# Altium schematic sheet ESP_SoC.SchDoc
size A3
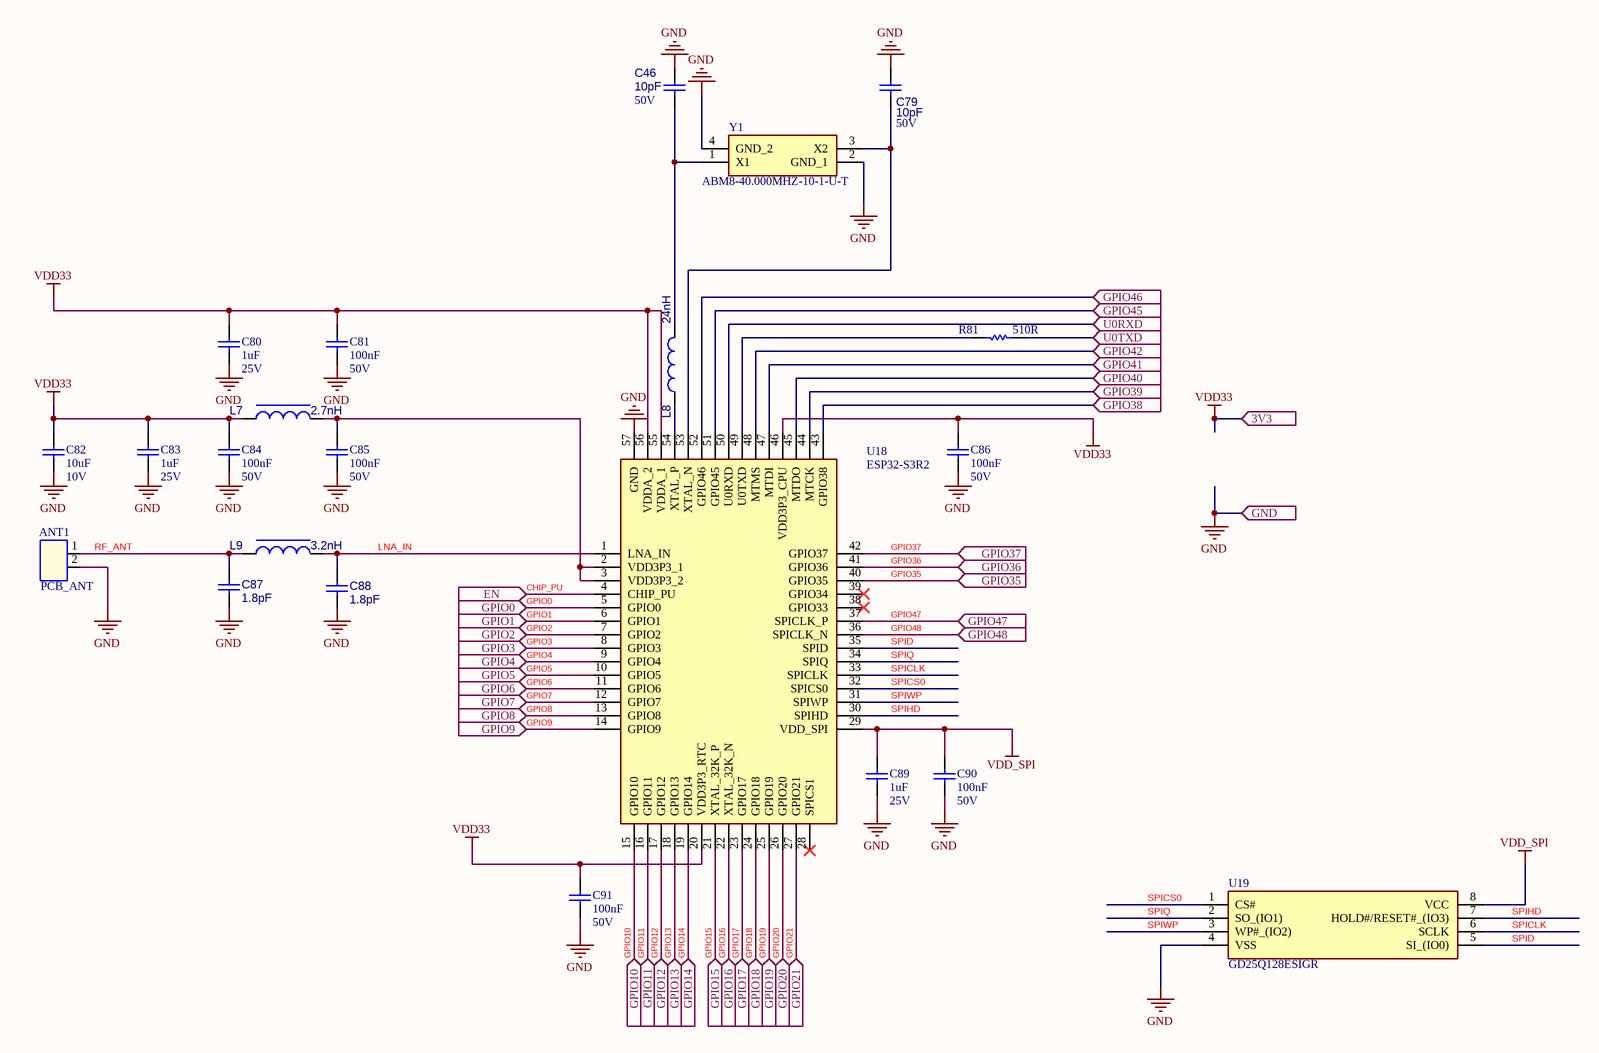
[diagram p0: ESP_SoC.SchDoc]

## Parts
ANT1  PCB_ANT  [MINI-ANT-TYPEB]  (no BOM)
C46  value 10pF  Voltage: 50V  [CAP_0603]  (hidden comment: CL10C100JB8NNNC)
C79  value 10pF  Voltage: 50V  [CAP_0603]  (hidden comment: CL10C100JB8NNNC)
C80  value 1uF  Voltage: 25V  [CAP_0603]  (hidden comment: CL10A105KA8NNNC)
C81  value 100nF  Voltage: 50V  [CAP_0603]  (hidden comment: CAP)
C82  value 10uF  Voltage: 10V  [CAP_0603]  (hidden comment: CL10A106MP8NNNC)
C83  value 1uF  Voltage: 25V  [CAP_0603]  (hidden comment: CL10A105KA8NNNC)
C84  value 100nF  Voltage: 50V  [CAP_0603]  (hidden comment: CL10B104KB8NNNL)
C85  value 100nF  Voltage: 50V  [CAP_0603]  (hidden comment: CL10B104KB8NNNL)
C86  value 100nF  Voltage: 50V  [CAP_0603]  (hidden comment: CL10B104KB8NNNL)
C87  value 1.8pF  [CAP_0402]  (hidden comment: GJM1555C1H1R8CB01J)
C88  value 1.8pF  [CAP_0402]  (hidden comment: GJM1555C1H1R8CB01J)
C89  value 1uF  Voltage: 25V  [CAP_0603]  (hidden comment: CL10A105KA8NNNC)
C90  value 100nF  Voltage: 50V  [CAP_0603]  (hidden comment: CL10B104KB8NNNL)
C91  value 100nF  Voltage: 50V  [CAP_0603]  (hidden comment: CAP)
L7  value 2.7nH  [res_0603]  (hidden comment: ELJRE2N7DFA)
L8  value 24nH  [res_0603]  (hidden comment: LQW18AN24NJ00J)
L9  value 3.2nH  [res_0402]  (hidden comment: LQW15AN3N2B0ZD)
R81  value 510R  [R0603]  (hidden comment: 0603SAJ0511T5E)
U18  ESP32-S3R2  [QFN40P700X700X90-57N-D]
U19  GD25Q128ESIGR  [SOIC127P790X216-8N]
Y1  ABM8-40.000MHZ-10-1-U-T  [ABM810000MHZ12D2W]

## Ports
3V3 (in), EN (in), GND (in), GPIO0 (in), GPIO1 (in), GPIO2 (in), GPIO3 (in), GPIO4 (in), GPIO5 (in), GPIO6 (in), GPIO7 (in), GPIO8 (in), GPIO9 (in), GPIO10 (in), GPIO11 (in), GPIO12 (in), GPIO13 (in), GPIO14 (in), GPIO15 (in), GPIO16 (in), GPIO17 (in), GPIO18 (in), GPIO19 (in), GPIO20 (in), GPIO21 (in), GPIO35 (in), GPIO36 (in), GPIO37 (in), GPIO38 (in), GPIO39 (in), GPIO40 (in), GPIO41 (in), GPIO42 (in), GPIO45 (in), GPIO46 (in), GPIO47 (in), GPIO48 (in), U0RXD (in), U0TXD (in)

## Nets
GND: ANT1.2 C46.1 C79.1 C80.2 C81.2 C82.2 C83.2 C84.2 C85.2 C86.2 C87.2 C88.2 C89.2 C90.2 C91.2 U18.57(GND) U19.4(VSS) Y1.2(GND_1) Y1.4(GND_2) ; port GND
VDD33: C80.1 C81.1 C82.1 C83.1 C84.1 C86.1 C91.1 L7.1 U18.20(VDD3P3_RTC) U18.46(VDD3P3_CPU) U18.55(VDDA_1) U18.56(VDDA_2) ; port 3V3
VDD_SPI: C89.1 C90.1 U18.29(VDD_SPI) U19.8(VCC)
CHIP_PU: U18.4(CHIP_PU) ; port EN
GPIO0: U18.5(GPIO0) ; port GPIO0
GPIO1: U18.6(GPIO1) ; port GPIO1
GPIO2: U18.7(GPIO2) ; port GPIO2
GPIO3: U18.8(GPIO3) ; port GPIO3
GPIO4: U18.9(GPIO4) ; port GPIO4
GPIO5: U18.10(GPIO5) ; port GPIO5
GPIO6: U18.11(GPIO6) ; port GPIO6
GPIO7: U18.12(GPIO7) ; port GPIO7
GPIO8: U18.13(GPIO8) ; port GPIO8
GPIO9: U18.14(GPIO9) ; port GPIO9
GPIO10: U18.15(GPIO10) ; port GPIO10
GPIO11: U18.16(GPIO11) ; port GPIO11
GPIO12: U18.17(GPIO12) ; port GPIO12
GPIO13: U18.18(GPIO13) ; port GPIO13
GPIO14: U18.19(GPIO14) ; port GPIO14
GPIO15: U18.21(XTAL_32K_P) ; port GPIO15
GPIO16: U18.22(XTAL_32K_N) ; port GPIO16
GPIO17: U18.23(GPIO17) ; port GPIO17
GPIO18: U18.24(GPIO18) ; port GPIO18
GPIO19: U18.25(GPIO19) ; port GPIO19
GPIO20: U18.26(GPIO20) ; port GPIO20
GPIO21: U18.27(GPIO21) ; port GPIO21
GPIO35: U18.40(GPIO35) ; port GPIO35
GPIO36: U18.41(GPIO36) ; port GPIO36
GPIO37: U18.42(GPIO37) ; port GPIO37
GPIO38: U18.43(GPIO38) ; port GPIO38
GPIO39: U18.44(MTCK) ; port GPIO39
GPIO40: U18.45(MTDO) ; port GPIO40
GPIO41: U18.47(MTDI) ; port GPIO41
GPIO42: U18.48(MTMS) ; port GPIO42
GPIO45: U18.51(GPIO45) ; port GPIO45
GPIO46: U18.52(GPIO46) ; port GPIO46
GPIO47: U18.37(SPICLK_P) ; port GPIO47
GPIO48: U18.36(SPICLK_N) ; port GPIO48
LNA_IN: C88.1 L9.2 U18.1(LNA_IN)
RF_ANT: ANT1.1 C87.1 L9.1
SPICLK: U18.33(SPICLK) U19.6(SCLK)
SPICS0: U18.32(SPICS0) U19.1(CS#)
SPID: U18.35(SPID) U19.5(SI_(IO0))
SPIHD: U18.30(SPIHD) U19.7(HOLD#/RESET#_(IO3))
SPIQ: U18.34(SPIQ) U19.2(SO_(IO1))
SPIWP: U18.31(SPIWP) U19.3(WP#_(IO2))
U0RXD: U18.50(U0RXD) ; port U0RXD
U0TXD: R81.1 ; port U0TXD
NetC46_2: C46.2 L8.2 Y1.1(X1)
NetC79_2: C79.2 U18.53(XTAL_N) Y1.3(X2)
NetC85_1: C85.1 L7.2 U18.2(VDD3P3_1) U18.3(VDD3P3_2)
NetL8_1: L8.1 U18.54(XTAL_P)
NetR81_2: R81.2 U18.49(U0TXD)

Not connected (* = marked no-connect by the designer): U18 28(SPICS1)* 38(GPIO33)* 39(GPIO34)*

## Notes on the sheet
- Title
- Size:
- Date:
- A3
- Number:
- Time:
- Revision:
- Sheet
- of
- Drawn by:

## Library data of the parts
C46 C79 = CL10C100JB8NNNC: MLCC (1608) 0603 10pF 50VDC ±5% C0G (NP0); Manufacturer: SAMSUNG; Package: 0603 (1608 Metric); Manufacturer Part Number: CL10C100JB8NNNC
C80 C83 C89 = C01757: CAP CER 1UF 25VDC %10 X5R SMD; Manufacturer: Samsung; Manufacturer Part Number: CL10A105KA8NNNC
C81 C91 = C01763: CAP CER 100nF 50VDC %10 X7R SMD; Manufacturer: Samsung; Manufacturer Part Number: CL10B104KB8NNNL
C82 = C01793: MLCC (1608) 0603 10uF 10VDC ±20% X5R; Manufacturer: Samsung; Manufacturer Part Number: CL10A106MP8NNNC
C84-C86 C90 = C01763: CAP CER 100nF 50VDC %10 X7R SMD; Manufacturer: Samsung; Manufacturer Part Number: CL10B104KB8NNNL
C87 C88 = CL05B104KB5NNNC: MLCC 1.8 pF 50 VDC 0.25 pF 0402 C0G (NP0); Manufacturer: Murata Electronics; Voltage: 0402 (1005 Metric); Manufacturer Part Number: GJM1555C1H1R8CB01J
L7 = 7447709150: INDUCTOR FIXED 2.7nH 500mA; Manufacturer: PANASONIC(EUROPE); Manufacturer Part Number: ELJRE2N7DFA
L8 = 7447709150: INDUCTOR FIXED 0603 24NH; Manufacturer: MURATA; Manufacturer Part Number: LQW18AN24NJ00J
L9 = 7447709150: FIXED IND 3.2NH 500MA 0.17OHM SM; Manufacturer: Murata Electronics; Manufacturer Part Number: LQW15AN3N2B0ZD
R81 = R03005: RES.(1608) 0603 510 Ohms 5% 1/10W-S 100PPM; Manufacturer: ROYALOHM; Manufacturer Part Number: 0603SAJ0511T5E
U18 = ESP32-S3: IC RF TXRX+MCU BLE 56QFN; Manufacturer: Espressif Systems; Manufacturer Part Number: ESP32-S3R2
U19 = GD25Q128ESIGR: IC FLASH 128MBIT SPI/QUAD 8SOP; Manufacturer: GigaDevice Semiconductor (HK) Limited; Manufacturer Part Number: GD25Q128ESIGR
Y1 = ABM8-40.000MHZ-10-1-U-T: CRYSTAL 40.0000MHZ 10PF SMD; Manufacturer: ABRACON; Manufacturer Part Number: ABM8-40.000MHZ-10-1-U-T